# Altium schematic sheet STM32F030K6T6 CH340.SchDoc
size A4
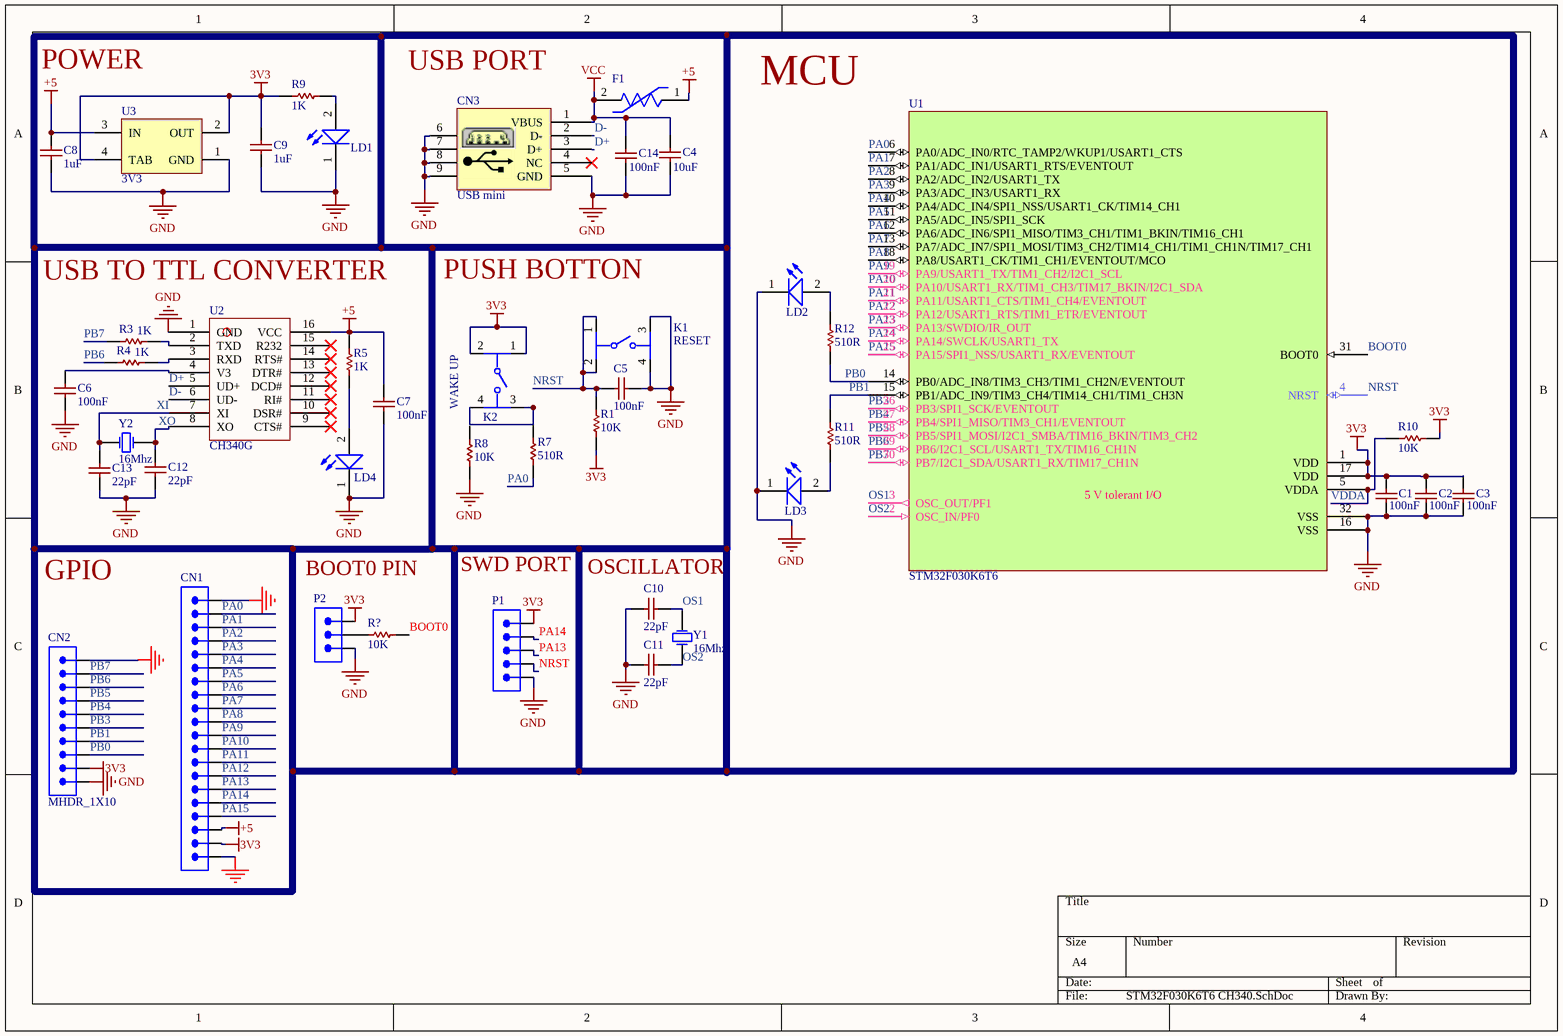
[diagram p0: STM32F030K6T6 CH340.SchDoc]

## Parts
C1  100nF  [CAP805]
C2  100nF  [CAP805]
C3  100nF  [CAP805]
C4  10uF  [CAP805]
C5  100nF  [CAP805]
C6  100nF  [CAP805]
C7  100nF  [CAP805]
C8  1uF  [CAP805]
C9  1uF  [CAP805]
C10  22pF  [CAP805]
C11  22pF  [CAP805]
C12  22pF  [CAP805]
C13  22pF  [CAP805]
C14  100nF  [CAP805]
CN1  MHDR_1X20  [MHDR1X20-254P]  (value not drawn)
CN2  MHDR_1X10  [MHDR1X10-254P - E]
CN3  USB mini  [USB/SM0.8-6H5]
F1  1206L025YR  [FP-1206L025YR-MFG]  (value not drawn)
K1  RESET  [FP-TL3305AF260QG-MFG]
K2  WAKE UP  [FP-TL3305AF260QG-MFG]
LD1  LED SMD PACKAGE  [LED_SMD_1206]  (value not drawn)
LD2  LED SMD PACKAGE  [LED_SMD_1206]  (value not drawn)
LD3  LED SMD PACKAGE  [LED_SMD_1206]  (value not drawn)
LD4  LED SMD PACKAGE  [LED_SMD_1206]  (value not drawn)
P1  MHDR_1X05  [MHDR1X05-254P]  (value not drawn)
P2  (no value)  [MHDR1X03-254P]
R1  10K  [RES1206 _(3216X08L)]
R3  1K  [RES1206 _(3216X08L)]
R4  1K  [RES1206 _(3216X08L)]
R5  1K  [RES1206 _(3216X08L)]
R7  510R  [RES1206 _(3216X08L)]
R8  10K  [RES1206 _(3216X08L)]
R9  1K  [RES1206 _(3216X08L)]
R10  10K  [RES1206 _(3216X08L)]
R11  510R  [RES1206 _(3216X08L)]
R12  510R  [RES1206 _(3216X08L)]
R?  10K  [RES1206 _(3216X08L)]
U1  STM32F030K6T6  [LQFP32]
U2  CH340G  [CH340G_C_B(SOP16)]
U3  3V3  [SOT223]
Y1  16Mhz  [Crystal]
Y2  16Mhz  [Crystal_smd]

## Nets
3V3: C1.2 C2.2 C3.2 C9.2 CN1.2 CN2.2 K2.1 K2.2 P1.5 P2.3 R1.1 R9.2 R10.1 U1.1(VDD) U1.17(VDD) U3.2(OUT) U3.4(TAB)
+5: C7.2 C8.2 CN1.3 F1.1 R5.1 U2.16(VCC) U3.3(IN)
GND: C1.1 C2.1 C3.1 C4.1 C5.1 C6.1 C7.1 C8.1 C9.1 C10.2 C11.2 C12.2 C13.2 C14.1 CN1.1 CN1.20 CN2.1 CN2.10 CN3.5(GND) CN3.6 CN3.7 CN3.8 CN3.9 K1.3 K1.4 LD1.1(K) LD2.1(K) LD3.1(K) LD4.1(K) P1.1 P2.1 R8.2 U1.16(VSS) U1.32(VSS) U2.1(GND) U3.1(GND)
VCC: C4.2 C14.2 CN3.1(VBUS) F1.2
BOOT0: R?.1 U1.31(BOOT0)
D+: CN3.3(D+) U2.5(UD+)
D-: CN3.2(D-) U2.6(UD-)
NRST: C5.2 K1.1 K1.2 P1.2 R1.2 U1.4(NRST)
OS1: C10.1 U1.3(OSC_OUT/PF1) Y1.2(OSC2)
OS2: C11.1 U1.2(OSC_IN/PF0) Y1.1(OSC1)
PA0: CN1.19 R7.1 U1.6(PA0/ADC_IN0/RTC_TAMP2/WKUP1/USART1_CTS)
PA1: CN1.18 U1.7(PA1/ADC_IN1/USART1_RTS/EVENTOUT)
PA2: CN1.17 U1.8(PA2/ADC_IN2/USART1_TX)
PA3: CN1.16 U1.9(PA3/ADC_IN3/USART1_RX)
PA4: CN1.15 U1.10(PA4/ADC_IN4/SPI1_NSS/USART1_CK/TIM14_CH1)
PA5: CN1.14 U1.11(PA5/ADC_IN5/SPI1_SCK)
PA6: CN1.13 U1.12(PA6/ADC_IN6/SPI1_MISO/TIM3_CH1/TIM1_BKIN/TIM16_CH1)
PA7: CN1.12 U1.13(PA7/ADC_IN7/SPI1_MOSI/TIM3_CH2/TIM14_CH1/TIM1_CH1N/TIM17_CH1)
PA8: CN1.11 U1.18(PA8/USART1_CK/TIM1_CH1/EVENTOUT/MCO)
PA9: CN1.10 U1.19(PA9/USART1_TX/TIM1_CH2/I2C1_SCL)
PA10: CN1.9 U1.20(PA10/USART1_RX/TIM1_CH3/TIM17_BKIN/I2C1_SDA)
PA11: CN1.8 U1.21(PA11/USART1_CTS/TIM1_CH4/EVENTOUT)
PA12: CN1.7 U1.22(PA12/USART1_RTS/TIM1_ETR/EVENTOUT)
PA13: CN1.6 P1.3 U1.23(PA13/SWDIO/IR_OUT)
PA14: CN1.5 P1.4 U1.24(PA14/SWCLK/USART1_TX)
PA15: CN1.4 U1.25(PA15/SPI1_NSS/USART1_RX/EVENTOUT)
PB0: CN2.3 R12.1 U1.14(PB0/ADC_IN8/TIM3_CH3/TIM1_CH2N/EVENTOUT)
PB1: CN2.4 R11.2 U1.15(PB1/ADC_IN9/TIM3_CH4/TIM14_CH1/TIM1_CH3N)
PB3: CN2.5 U1.26(PB3/SPI1_SCK/EVENTOUT)
PB4: CN2.6 U1.27(PB4/SPI1_MISO/TIM3_CH1/EVENTOUT)
PB5: CN2.7 U1.28(PB5/SPI1_MOSI/I2C1_SMBA/TIM16_BKIN/TIM3_CH2)
PB6: CN2.8 R4.2 U1.29(PB6/I2C1_SCL/USART1_TX/TIM16_CH1N)
PB7: CN2.9 R3.2 U1.30(PB7/I2C1_SDA/USART1_RX/TIM17_CH1N)
VDDA: R10.2 U1.5(VDDA)
XI: C13.1 U2.7(XI) Y2.1(OSC1)
XO: C12.1 U2.8(XO) Y2.2(OSC2)
NetC6_2: C6.2 U2.4(V3)
NetK2_3: K2.3 K2.4 R7.2
NetLD1_2: LD1.2(A) R9.1
NetLD2_2: LD2.2(A) R12.2
NetLD3_2: LD3.2(A) R11.1
NetLD4_2: LD4.2(A) R5.2
NetP2_2: P2.2 R?.2
NetR3_1: R3.1 U2.2(TXD)
NetR4_1: R4.1 U2.3(RXD)

Not connected (* = marked no-connect by the designer): CN3 4(NC)*; R8 1; U2 9(CTS#)* 10(DSR#)* 11(RI#)* 12(DCD#)* 13(DTR#)* 14(RTS#)* 15(R232)*

## Notes on the sheet
- POWER
- (near CN3) USB PORT
- MCU
- USB TO TTL CONVERTER
- PUSH BOTTON
- GPIO
- BOOT0 PIN
- (near P1) SWD PORT
- (near C10) OSCILLATOR
- (in symbol STM32F030K6T6) 5 V tolerant I/O

## Library data of the parts
C1-C3 C5-C7 C14 = CAP SMD: Designer: Majid Derhambakhsh; Desc.: CAP SMD TOTAL PACKAGES; VALUE: 100nF
C4 C8-C13 = CAP SMD: Designer: Majid Derhambakhsh; Desc.: CAP SMD TOTAL PACKAGES; VALUE: 100nF
CN1 = MHDR_1X20: Male Header 1X20
CN2 = MHDR_1X10: Male Header 1X10
CN3 = USB mini: mini USB Connector
F1 = CMP-08606-000079-1: PTC RESET FUSE 16V 250MA 1206; Resistance: 2.3R; Trip Current: 500mA; Approvals: cULus; Max Current Rating: 100A; Time to Trip: 0.08s; Max Power Dissipation: 600mW; Length: 3.4mm; REACH SVHC: No SVHC; Terminal Material: Copper; Case Code (Imperial): 1206; Packaging: Tape and Reel; Hold Current: 250mA; Min Operating Temperature: -40°C; Termination: SMD/SMT; Lead Free: Lead Free; Series: 1206L; Package Quantity: 4000; Voltage Rating (DC): 16V; Operating Supply Voltage: 16V; Case Code (Metric): 3216; Working Voltage: 16V; Voltage Rating: 16V; RoHS Compliant: Yes; Max Voltage Rating (DC): 16V; Height: 1mm; Current Rating: 100A; Power Dissipation: 600mW; Max Operating Temperature: 85°C; Width: 1.8mm; Case/Package: 1206
K1 K2 = CMP-17879-000010-1: SWITCH TACTILE SPST-NO 50MA 12V; Mechanical Life: 200000Cycles; Switch Function: Off-Mom; Actuator Type: Standard; Operating Force: 260gf; Illumination Type: Non-Illuminated; Switch Travel: 0.2mm; Throw Configuration: SPST; Min Operating Temperature: -20°C; Max Operating Temperature: 70°C; Lead Free: Lead Free; Mount: Surface Mount; Packaging: Tape and Reel; Termination: Gull Wing
LD1-LD4 = LED SMD PACKAGE: SMD Mono-color Chip LED Waterclear; Part Number: 150080BS75000; Peak Wavelength: 465 nm; Forward Voltage: 3.2 V; Published Date: Jan 2017; Publisher: Ali Hafizi
P1 = MHDR_1X05: Male Header 1X05
P2 = MHDR_1X03: Male Header 1X03
R1 R7 R8 R10-R12 R? = RES SMD: TOTAL SMD RESISTOR PACK; Designer: Majid Derhambakhsh; Desc.: RES SMD PAKAGES; Value: 1K; Data: 2017-3-10
R3-R5 R9 = RES SMD: TOTAL SMD RESISTOR PACK; Designer: Majid Derhambakhsh; Desc.: RES SMD PAKAGES; Data: 2017-3-10; Value: 1K
U1 = STM32F030K6T6: ARM Microcontrollers - MCU Value-Line ARM MCU 32kB 48 MHz; Link: http://javanelec.com/productsDetails.aspx?id=32660
U2 = CH340G_C_B
U3 = AMS1117-x.x: x.x Volt, 800mA Low-Dropout Linear Regulator, 4-pin SOT-223; Designer: Ali Hafizi; Data: 16-12-2016
Y1 Y2 = XTAL: Crystal Oscillator; Published: 8-Jun-2000; LatestRevisionDate: 17-Jul-2002; LatestRevisionNote: Re-released for DXP Platform.; PackageReference: R38; Publisher: Altium Limited